# Altium schematic sheet 16-Power.SchDoc
size A; SheetNumber: 16; SheetTotal: 16
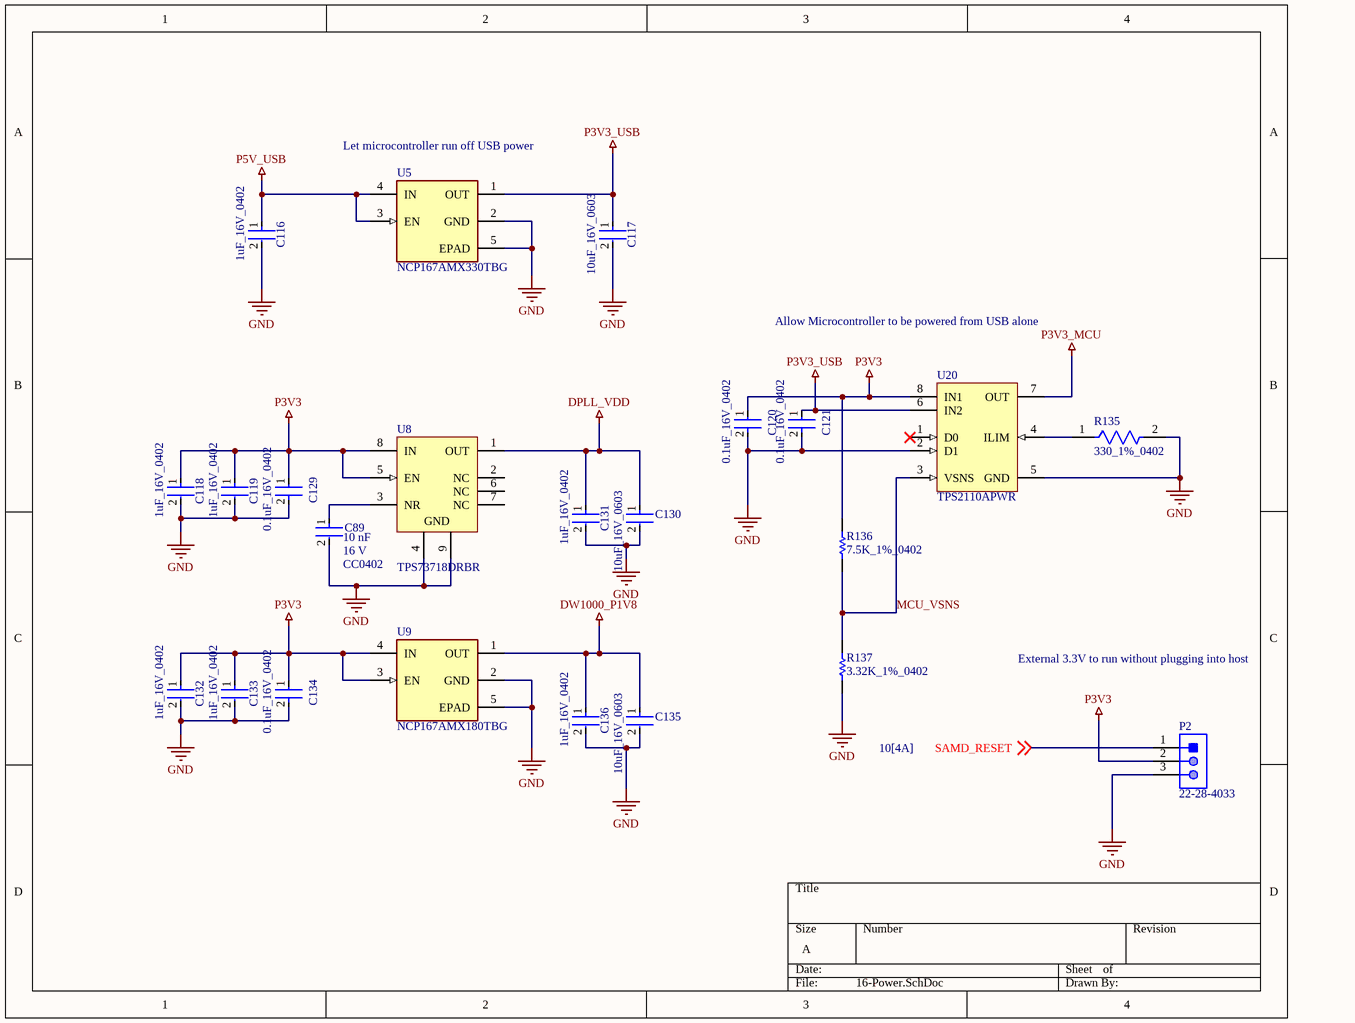
[diagram p0: 16-Power.SchDoc]

## Parts
C89  value 10 nF  Package: CC0402  Voltage Rating: 16 V  [FP-CC0402-MFG]  (hidden comment: CC0402KRX7R7BB103)
C116  1uF_16V_0402  [FP-0402-L_1_0_0_05-W_0_5-IPC_C]
C117  10uF_16V_0603  [FP-C1608-MFG]
C118  1uF_16V_0402  [FP-0402-L_1_0_0_05-W_0_5-IPC_C]
C119  1uF_16V_0402  [FP-0402-L_1_0_0_05-W_0_5-IPC_C]
C120  0.1uF_16V_0402  [FP-GRM15-MFG]
C121  0.1uF_16V_0402  [FP-GRM15-MFG]
C129  0.1uF_16V_0402  [FP-GRM15-MFG]
C130  10uF_16V_0603  [FP-MK107BA-IPC_A]
C131  1uF_16V_0402  [FP-0402-L_1_0_0_05-W_0_5-IPC_C]
C132  1uF_16V_0402  [FP-0402-L_1_0_0_05-W_0_5-IPC_C]
C133  1uF_16V_0402  [FP-0402-L_1_0_0_05-W_0_5-IPC_C]
C134  0.1uF_16V_0402  [FP-GRM15-MFG]
C135  10uF_16V_0603  [FP-MK107BA-IPC_A]
C136  1uF_16V_0402  [FP-0402-L_1_0_0_05-W_0_5-IPC_C]
P2  22-28-4033  [MOLX-22-28-4033_V]
R135  330_1%_0402  [FP-RC1005-IPC_B]
R136  7.5K_1%_0402  [RESC1005X40X25ML05T05]
R137  3.32K_1%_0402  [RESC1005X40X25NL05T05]
U5  NCP167AMX330TBG  [FP-711AJ-MFG]
U8  TPS73718DRBR  [DRB0008A_V]
U9  NCP167AMX180TBG  [FP-711AJ-MFG]
U20  TPS2110APWR  [PW0008A_L]

## Nets
DPLL_VDD: C130.1 C131.1 U8.1(OUT)
DW1000_P1V8: C135.1 C136.1 U9.1(OUT)
GND: C89.2 C116.2 C117.2 C118.2 C119.2 C120.2 C121.2 C129.2 C130.2 C131.2 C132.2 C133.2 C134.2 C135.2 C136.2 P2.3 R135.2 R137.1 U5.2(GND) U5.5(EPAD) U8.4(GND) U8.9(GND) U9.2(GND) U9.5(EPAD) U20.2(D1) U20.5(GND)
P3V3: C118.1 C119.1 C120.1 C129.1 C132.1 C133.1 C134.1 P2.2 R136.2 U8.5(EN) U8.8(IN) U9.3(EN) U9.4(IN) U20.8(IN1)
P3V3_MCU: U20.7(OUT)
P3V3_USB: C117.1 C121.1 U5.1(OUT) U20.6(IN2)
P5V_USB: C116.1 U5.3(EN) U5.4(IN)
MCU_VSNS: R136.1 R137.2 U20.3(VSNS)
SAMD_RESET: P2.1 ; off-sheet SAMD_RESET
NetC89_1: C89.1 U8.3(NR)
NetR135_1: R135.1 U20.4(ILIM)

Not connected (* = marked no-connect by the designer): U8 2(NC) 6(NC) 7(NC); U20 1(D0)*

## Notes on the sheet
- (near U5) Let microcontroller run off USB power
- Allow Microcontroller to be powered from USB alone
- External 3.3V to run without plugging into host

## Library data of the parts
C89 = CMP-03422-000501-1: CAP CER 10000PF 16V X7R 0402; Manufacturer: YAGEO; Automotive Grade: NA; Material: Ceramic; Tolerance: 0.1; Temperature Coefficient: 30ppm/°C; Temperature Range Low: -55°C; Temperature Range High: +125°C; Mouser Description: 0402 10 nF 16 V ±10 % Tolerance X7R SMT Multilayer Ceramic Capacitor; Footprint Url: http://www.yageo.com/exep/pages/download/literatures/UPY-C_GEN_24.pdf; Category: Cap; RoHS: TRUE; Capacitance: 10 nF; Manufacturer Part Number: CC0402KRX7R7BB103; ComponentLink2Description: Datasheet; Ipc Land Pattern Name: CAPC10050X50; Automotive: No; ComponentLink2URL: http://www.yageo.com/documents/recent/UPY-GP_NP0_16V-to-50V_16.pdf; Device Class L1: Passive Components; Height: 0.55mm; Temperature Characteristic: X7R; Device Class L3: Ceramic Capacitors; Lead Free: Yes; Device Class L2: Capacitors; Digikey Description: CAP CER 10000PF 16V X7R 0402; Octopart: https://octopart.com/cc0402krx7r7bb103-yageo-192895; Temperature: -55°C to +125°C
C116 C118 C119 C131-C133 C136 = CMP-14477-003537-2: None; Tolerance: 20%; Voltage Rating (DC): 16V; Capacitance: 1uF; Dielectric: X5R; Height: 0.5mm; Package Quantity: 10000; Series: M; Max Operating Temperature: 85°C; Width: 0.02inch; Mount: Surface Mount; Thickness: 0.022inch; Length: 1mm; Min Operating Temperature: -55°C; Depth: 0.5mm; RoHS Compliant: Yes; Construction: Flat; Case/Package: 0402; Radiation Hardening: No; Packaging: Tape and Reel; Voltage: 16V; Voltage Rating: 16V; Halogen Free: Halogen Free
C117 = CMP-08246-000019-1: CAP CER 10UF 16V X5R 0603; Manufacturer: TDK Corporation; Manufacturer Part Number: C1608X5R1C106M080AB; Temperature Coefficient: 15%; Tolerance: 20%; Material: Ceramic; Octopart: https://octopart.com/c1608x5r1c106m080ab-tdk-26013480; ComponentLink2Description: Datasheet; Value: 10uF; Temperature Range Low: -55°C; Digikey Description: CAP CER 10UF 16V X5R 0603; Package: C1608; Lead Free: Yes; Mouser Description: Multilayer Ceramic Capacitors MLCC - SMD/SMT 0603 10uF 16volts X5R +/-20% GP; Device Class L2: Capacitors; Voltage Rating: 16V; RoHS: TRUE; Automotive: No; Height: 0.9mm; Ipc Land Pattern Name: CAPC16080X80; ComponentLink2URL: https://upverter.com/datasheet/6fbac97fd59b4a24a005814037d2a36a27db40e9.pdf; Temperature Range High: +85°C; Capacitance: 10uF; Temperature: -55°C to +85°C; Category: Cap; Device Class L1: Passive Components; Device Class L3: Ceramic Capacitors; Temperature Characteristic: X5R
C120 C121 C129 C134 = CMP-2100-03641-2: CAP CER 0.1UF 16V X7R 0402; Manufacturer Part Number: GRM155R71C104KA88D; Manufacturer: Murata; Standoff Height: 0mm; Tolerance: 10%; Voltage Rating: 16Vdc; Material: Ceramic; Capacitance: 0.10μF; Value: 0.10μF; RoHS: TRUE; Temperature Characteristic: X7R; Octopart: https://octopart.com/grm155r71c104ka88d-murata-196880; Digikey Description: CAP CER 0.1UF 16V X7R 0402; Device Class L3: Ceramic Capacitors; Height: 0.55mm; ComponentLink2Description: Datasheet; Temperature Range Low: -55°C; Ipc Land Pattern Name: CAPC10050X219; ComponentLink2URL: https://search.murata.co.jp/Ceramy/image/img/A01X/G101/ENG/GRM155R71H471KA01-01A.pdf; Device Class L1: Passive Components; Lead Free: yes; Category: Cap; Package: GRM15; Temperature: -55°C to +125°C; Device Class L2: Capacitors; Temperature Range High: +125°C; Mouser Description: 0402 0.1 uF 16V ±10 % Tolerance X7R SMT Multilayer Ceramic Capacitor
C130 C135 = CMP-2000-06226-3: None; Dielectric: X5R; Voltage Rating: 16V; Tolerance: 20%; Capacitance: 10uF; Packaging: Tape and Reel; Mount: Surface Mount; Height: 0.8mm; Series: M; Min Operating Temperature: -55°C; Max Operating Temperature: 85°C; Thickness: 0.031inch; Construction: Flat; Case/Package: 0603; Case Code (Metric): 1608; Package Quantity: 1; Case Code (Imperial): 0603; Voltage Rating (DC): 16V; Halogen Free: Halogen Free; Length: 0.063inch; Width: 0.031inch; Termination: SMD/SMT; RoHS Compliant: Yes
P2 = CMP-1676-00001-5: Male Header, Pitch 2.54 mm, 1 x 3 Position, Height 8.38 mm, Tail Length 3.18 mm, RoHS, Bulk; Manufacturer: Molex; Rows: 1; Voltage Rating: 250 V; Current Rating: 4 A; Min Operating Temperature: 0 degC; Lead Pitch: 0.1 inch; Packaging: Bulk; Contact Finish: Gold; RoHSCompliant: true; Contact Material: Brass; PackageReference: 22-28-4033; REACH SVHC: Unknown; PackageDescription: Male Header, Pitch 2.54 mm, 1 x 3 Position, Height 8.38 mm, Tail Length 3.18 mm; ComponentLink2URL: http://www.molex.com/pdm_docs/sd/022284033_sd.pdf; Height: 8.38 mm; Mounting Technology: Through Hole; ComponentLink1Description: Manufacturer URL; Length: 7.62 mm; Mount: Through Hole; DatasheetVersion: Rev. G, 01/2012; Max Operating Temperature: 75 degC; ComponentLink2Description: Datasheet; Colour: Black; Pins: 3; Contact Plating: Gold; Package Quantity: 1; ComponentLink1URL: http://www.molex.com/
R135 = CMP-13261-004965-1: Res Thick Film 0402 330Ω 1% 0.063W ±100ppm/°C Molded SMD T/R; Resistance: 330R; Max Power Dissipation: 63mW; Contact Plating: Tin; Case/Package: 0402; Width: 0.02inch; Min Operating Temperature: -55°C; Composition: Thick Film; Package Quantity: 1; Length: 0.039inch; Case Code (Imperial): 0402; Case Code (Metric): 1005; Height: 0.016inch; Features: Moisture Resistant; Radiation Hardening: No; Military Standard: Not; Depth: 0.5mm; Temperature Coefficient: 100ppm/°C; Max Operating Temperature: 155°C; Packaging: Tape and Reel; Tolerance: 1%; Number of Terminations: 2; Power Rating: 63mW
R136 = CMP-2002-00353-1: Manufacturer: Vishay Dale; Part Number: CRCW04027K50FKTD
R137 = CMP-1011-00568-2: Manufacturer: Vishay Dale; Part Number: CRCW04023K32FKTD
U5 = CMP-07128-000018-1: LDO 700 MA ULTRA-LOW NOI; Manufacturer: ON Semiconductor; Accuracy Percentage: 2%; Output Type: Fixed; Output Current: 700mA; Number Of Outputs: 1; Min Supply Voltage: 1.9V; Dropout Voltage: 190mV; Output Voltage: 3.3V; Standoff Height: 0mm; Max Supply Voltage: 5.5V; Max Junction Temp: +150°C; Nominal Supply Current: 9.7uA; Device Class L1: Integrated Circuits (ICs); Octopart: https://octopart.com/ncp167amx330tbg-on+semiconductor-85869721; Footprint Url: https://www.onsemi.com/pub/Collateral/711AJ.PDF; Height: 0.43mm; ComponentLink2Description: Datasheet; Temperature Range High: +150°C; Lead Free: Yes; Package: 711AJ; Device Class L3: Voltage Regulators - Linear; ComponentLink2URL: https://www.onsemi.com/pub/Collateral/NCP167-D.PDF; Temperature: to +150°C; Category: IC; Device Class L2: Power Management ICs; Digikey Description: LDO 700 MA ULTRA-LOW NOI; Manufacturer Part Number: NCP167AMX330TBG; Automotive: No; RoHS: TRUE
U8 = CMP-0395-00613-2: Single Output LDO, 1 A, Fixed 1.8 V Output, 2.2 to 5.5 V Input, with Reverse Current Protection, 8-pin SON (DRB), -40 to 125 degC, Green (RoHS & no Sb/Br); Manufacturer: Texas Instruments; Fixed Output Options(V): 1.8; Vin(Min)(V): 2.2; Iq(Typ)(mA): 0.3; Accuracy(%): 3; Vdo(Typ)(mV): 130; SubFamily: Single Channel LDO; Vin(Max)(V): 5.5; Iout(Max)(A): 1; Rating: Catalog; Vout Adj(Min)(V): 1.8; ComponentLink2Description: Datasheet; PartNumber: TPS73718DRBR; Vout Adj(Max)(V): 1.8; ComponentLink3URL: http://www.ti.com/litv/pdf/mpds118h; PackageDescription: 8-Pin Plastic Small Outline, Body 3 x 3 mm, Pitch 0.65 mm; ComponentLink1Description: Manufacturer URL; ComponentLink1URL: http://www.ti.com/; ComponentLink3Description: Package Specification; PackageVersion: 4203482-2/K; Eco-Plan: Green (RoHS & no Sb/Br); PackageReference: DRB0008A; Mounting Technology: Surface Mount; ComponentLink2URL: http://www.ti.com/general/docs/lit/getliterature.tsp?genericPartNumber=TPS73718&fileType=pdf; DatasheetVersion: SBVS067O
U9 = CMP-07128-000018-1: LDO 700 MA ULTRA-LOW NOI; Manufacturer: ON Semiconductor; Accuracy Percentage: 2%; Output Type: Fixed; Output Current: 700mA; Number Of Outputs: 1; Min Supply Voltage: 1.9V; Dropout Voltage: 190mV; Output Voltage: 1.8V; Standoff Height: 0mm; Max Supply Voltage: 5.5V; Max Junction Temp: +150°C; Nominal Supply Current: 9.7uA; Device Class L1: Integrated Circuits (ICs); Octopart: https://octopart.com/ncp167amx330tbg-on+semiconductor-85869721; Footprint Url: https://www.onsemi.com/pub/Collateral/711AJ.PDF; Height: 0.43mm; ComponentLink2Description: Datasheet; Temperature Range High: +150°C; Lead Free: Yes; Package: 711AJ; Device Class L3: Voltage Regulators - Linear; ComponentLink2URL: https://www.onsemi.com/pub/Collateral/NCP167-D.PDF; Temperature: to +150°C; Category: IC; Device Class L2: Power Management ICs; Digikey Description: LDO 700 MA ULTRA-LOW NOI; Manufacturer Part Number: NCP167AMX180TBG; Automotive: No; RoHS: TRUE
U20 = CMP-0339-00059-2: Dual In / Single Out Autoswitching Power Mux, 2.8 to 5.5 V, -40 to 85 degC, 8-pin TSSOP (PW), Green (RoHS & no Sb/Br); Manufacturer: Texas Instruments; SubFamily: Power Multiplexer (MUX); Number of Inputs: 2; IN2 Output Current(Max)(A): 0.75; IN1 rDS(on)(Typ)(mOhm): 120; IN1, IN2 Input Voltage(Max)(V): 5.5; IN2 rDS(on)(Typ)(Ohms): 0.12; IN1, IN2 Input Voltage(Min)(V): 2.8; PackageReference: PW0008A; ComponentLink1URL: http://www.ti.com/general/docs/lit/getliterature.tsp?genericPartNumber=TPS2110A&fileType=pdf; ComponentLink1Description: Datasheet; PackageDescription: 8-Pin Plastic Thin Small Outline Package 3 x 4.4 mm Body ,0.65 mm Pitch; Eco-Plan: Green (RoHS & no Sb/Br); PartNumber: TPS2110APWR; PackageVersion: revG, Feb-2011; Code_JEDEC: MO-153; IN1 Output Current(Max)(A): 0.75; Mounting Technology: Surface Mount; DatasheetVersion: SBVS043A